# Altium schematic sheet Input Pins.SchDoc
size A4
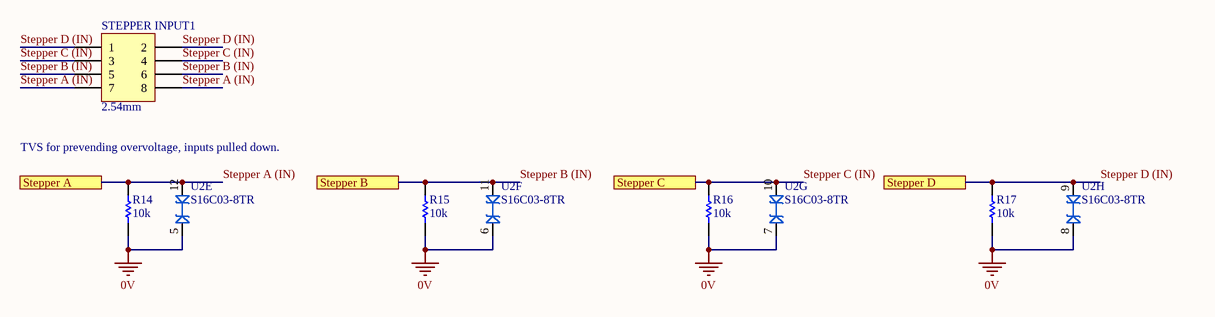
[diagram p0: Input Pins.SchDoc]

## Parts
R14  10k  [0805]
R15  10k  [0805]
R16  10k  [0805]
R17  10k  [0805]
STEPPER_INPUT1  2.54mm  [Header 2x4]
U2  S16C03-8TR  [SMC 16-SOIC]  (parts E,F,G,H of 8)

## Ports
Stepper A, Stepper B, Stepper C, Stepper D

## Nets
0V: R14.1 R15.1 R16.1 R17.1 U2.5(A) U2.6(A) U2.7(A) U2.8(A)
Stepper A (IN): R14.2 STEPPER_INPUT1.7 STEPPER_INPUT1.8 U2.12(A) ; port Stepper A
Stepper B (IN): R15.2 STEPPER_INPUT1.5 STEPPER_INPUT1.6 U2.11(A) ; port Stepper B
Stepper C (IN): R16.2 STEPPER_INPUT1.3 STEPPER_INPUT1.4 U2.10(A) ; port Stepper C
Stepper D (IN): R17.2 STEPPER_INPUT1.1 STEPPER_INPUT1.2 U2.9(A) ; port Stepper D

## Notes on the sheet
- TVS for prevending overvoltage, inputs pulled down.
- Title
- Size:
- Date:
- A4
- Number:
- Time:
- Revision:
- Sheet
- of
- File:

## Library data of the parts
R14-R17 = RC0805FR0710KL: Manufacturer: YAGEO; Tolerance: 0.01; Rated Voltage: 0.125W; Part Number: RC0805FR0710KL; Value: 10k; Material: FR-07; qty: 50
STEPPER_INPUT1 = Header 2x4: Positions: 8; Angle: 0; Flange: No; Contact: NA; Part Number: Header 2x4; Pitch: 2.54mm; Row Spacing: 2.54mm
U2 = S16C03-8TR: PD 300W VWM 3.3VCJ 425PFPACKAGE; Manufacturer: SMC Diode; Part Number: S16C03-8TR; Digikey Part Number: 1655-2152-2-ND; Digikey Link: https://www.digikey.com/product-detail/en/smc-diode-solutions/S16C03-8TR/1655-2152-2-ND/9816814